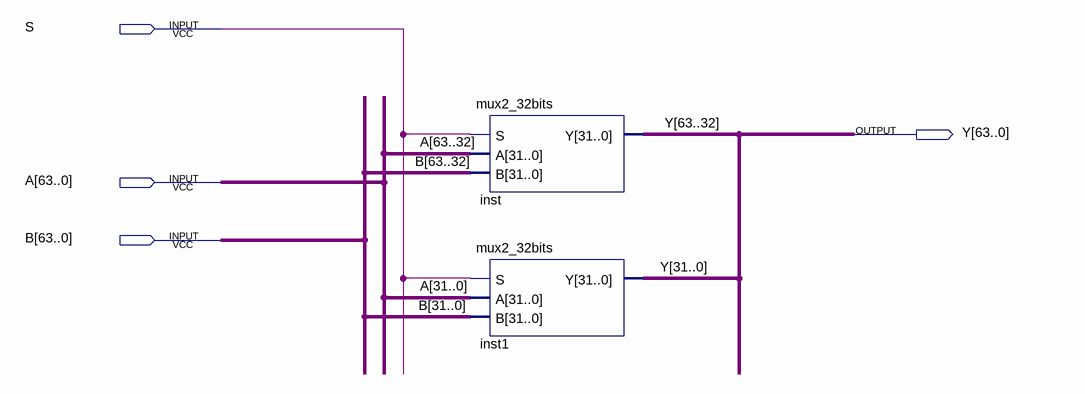
[diagram p0: schematic sheet]
// Quartus schematic mux2_64bits.bdf as structural Verilog: 2 symbols, 4 pins
module mux2_64bits (
  input  S,
  input  [63:0] A,
  input  [63:0] B,
  output [63:0] Y
);

  mux2_32bits inst (.S(S), .A(A[63:32]), .B(B[63:32]), .Y(Y[63:32]));
  mux2_32bits inst1 (.S(S), .A(A[31:0]), .B(B[31:0]), .Y(Y[31:0]));
endmodule
